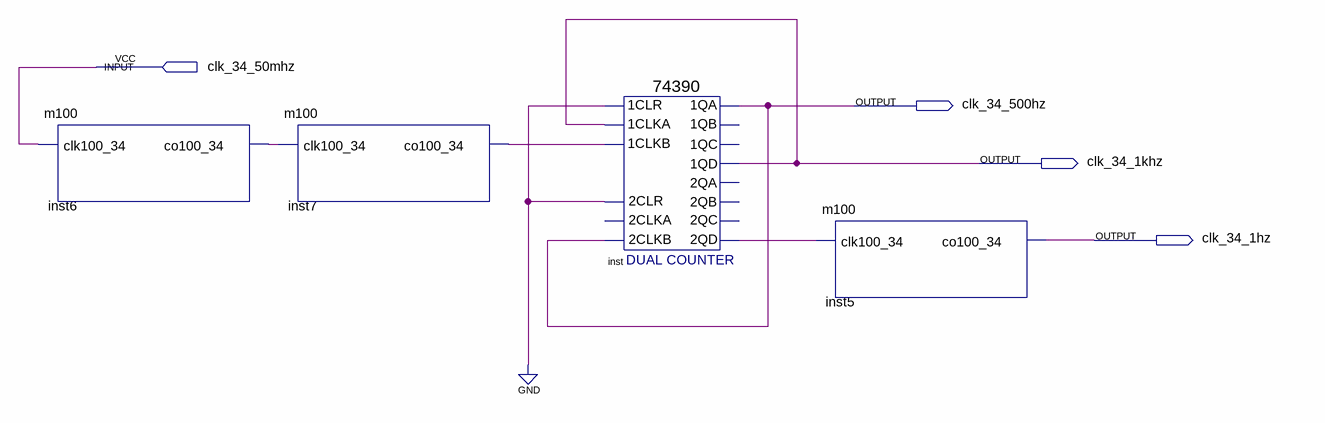
[diagram p0: schematic sheet]
// Quartus schematic fre_div.bdf as structural Verilog: 4 symbols, 4 pins
module fre_div (
  input  clk_34_50mhz,
  output clk_34_500hz,
  output clk_34_1khz,
  output clk_34_1hz
);

  wire inst6_co100_34, inst7_co100_34, inst_2qd;

  m100 inst6 (.clk100_34(clk_34_50mhz), .co100_34(inst6_co100_34));
  m100 inst7 (.clk100_34(inst6_co100_34), .co100_34(inst7_co100_34));
  \74390  inst (
    .\2CLR (1'b0), .\2CLKB (clk_34_500hz), .\1CLR (1'b0), .\1CLKA (clk_34_1khz), .\1CLKB (inst7_co100_34),
    .\1QA (clk_34_500hz), .\1QD (clk_34_1khz), .\2QD (inst_2qd));  // open: 2CLKA, 1QB, 1QC, 2QA, 2QB, 2QC
  m100 inst5 (.clk100_34(inst_2qd), .co100_34(clk_34_1hz));
endmodule
